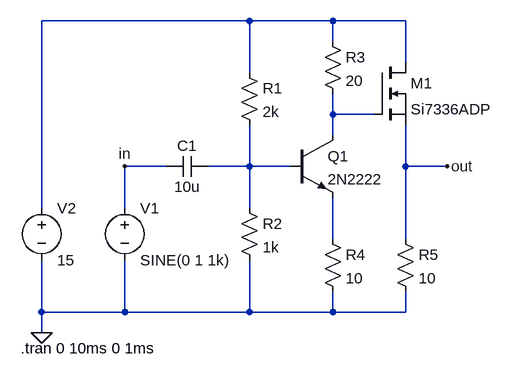
[diagram p0: schematic npnnmosamp.asc]
npnnmosamp.asc, the LTspice schematic file:
Version 4
SHEET 1 880 680
WIRE -112 -144 -432 -144
WIRE 16 -144 -112 -144
WIRE 128 -144 16 -144
WIRE 16 -112 16 -144
WIRE 128 -80 128 -144
WIRE -112 -64 -112 -144
WIRE 16 0 16 -32
WIRE 80 0 16 0
WIRE 16 32 16 0
WIRE -240 80 -304 80
WIRE -112 80 -112 16
WIRE -112 80 -176 80
WIRE -48 80 -112 80
WIRE 128 80 128 16
WIRE 192 80 128 80
WIRE -432 144 -432 -144
WIRE -304 144 -304 80
WIRE -112 144 -112 80
WIRE 16 192 16 128
WIRE 128 192 128 80
WIRE -432 304 -432 224
WIRE -304 304 -304 224
WIRE -304 304 -432 304
WIRE -112 304 -112 224
WIRE -112 304 -304 304
WIRE 16 304 16 272
WIRE 16 304 -112 304
WIRE 128 304 128 272
WIRE 128 304 16 304
WIRE -432 336 -432 304
FLAG -432 336 0
FLAG -304 80 in
FLAG 192 80 out
SYMBOL npn -48 32 R0
SYMATTR InstName Q1
SYMATTR Value 2N2222
SYMBOL nmos 80 -80 R0
SYMATTR InstName M1
SYMATTR Value Si7336ADP
SYMBOL cap -176 64 R90
WINDOW 0 0 32 VBottom 2
WINDOW 3 32 32 VTop 2
SYMATTR InstName C1
SYMATTR Value 10u
SYMBOL res -128 -80 R0
SYMATTR InstName R1
SYMATTR Value 2k
SYMBOL res -128 128 R0
SYMATTR InstName R2
SYMATTR Value 1k
SYMBOL res 0 -128 R0
SYMATTR InstName R3
SYMATTR Value 20
SYMBOL res 0 176 R0
SYMATTR InstName R4
SYMATTR Value 10
SYMBOL res 112 176 R0
SYMATTR InstName R5
SYMATTR Value 10
SYMBOL voltage -304 128 R0
WINDOW 123 0 0 Left 0
WINDOW 39 0 0 Left 0
SYMATTR InstName V1
SYMATTR Value SINE(0 1 1k)
SYMBOL voltage -432 128 R0
WINDOW 123 0 0 Left 0
WINDOW 39 0 0 Left 0
SYMATTR InstName V2
SYMATTR Value 15
TEXT -464 360 Left 2 !.tran 0 10ms 0 1ms

The netlist it stands for:
* npnnmosamp.asc
Q1 N002 N003 N004 0 2N2222
M1 N001 N002 out out Si7336ADP
C1 N003 in 10u
R1 N001 N003 2k
R2 N003 0 1k
R3 N001 N002 20
R4 N004 0 10
R5 out 0 10
V1 in 0 SINE(0 1 1k)
V2 N001 0 15
.model NPN NPN
.model PNP PNP
.lib standard.bjt
.model NMOS NMOS
.model PMOS PMOS
.lib standard.mos
.tran 0 10ms 0 1ms
.backanno
.end